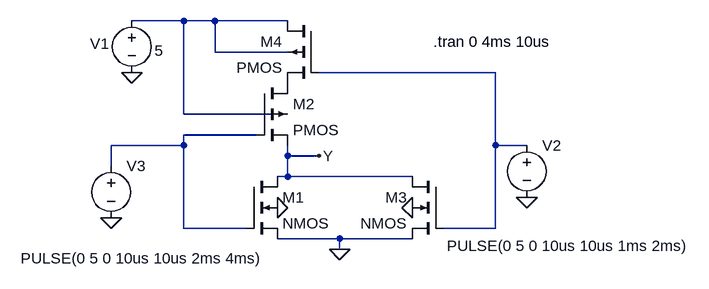
[diagram p0: schematic NOR2.asc]
NOR2.asc, the LTspice schematic file:
Version 4
SHEET 1 1048 680
WIRE -64 -192 -144 -192
WIRE -16 -192 -64 -192
WIRE 96 -192 -16 -192
WIRE -16 -144 -16 -192
WIRE 96 -144 -16 -144
WIRE 416 -112 144 -112
WIRE -64 -48 -64 -192
WIRE 96 -48 -64 -48
WIRE 48 -16 -64 -16
WIRE -64 0 -64 -16
WIRE -64 0 -176 0
WIRE 416 0 416 -112
WIRE 464 0 416 0
WIRE 96 16 96 0
WIRE 144 16 96 16
WIRE -176 32 -176 0
WIRE 96 48 96 16
WIRE 96 48 80 48
WIRE 288 48 96 48
WIRE -64 128 -64 0
WIRE 32 128 -64 128
WIRE 416 128 416 0
WIRE 416 128 336 128
WIRE 176 144 80 144
WIRE 288 144 176 144
WIRE 176 160 176 144
FLAG 80 96 0
FLAG 288 96 0
FLAG -144 -112 0
FLAG 464 80 0
FLAG -176 112 0
FLAG 176 160 0
FLAG 144 16 Y
SYMBOL voltage -144 -208 R0
WINDOW 123 0 0 Left 2
WINDOW 39 0 0 Left 2
WINDOW 0 -64 51 Left 2
WINDOW 3 35 62 Left 2
SYMATTR InstName V1
SYMATTR Value 5
SYMBOL voltage 464 -16 R0
WINDOW 3 -123 171 Left 2
WINDOW 123 0 0 Left 2
WINDOW 39 0 0 Left 2
SYMATTR Value PULSE(0 5 0 10us 10us 1ms 2ms)
SYMATTR InstName V2
SYMBOL voltage -176 16 R0
WINDOW 3 -139 158 Left 2
WINDOW 123 0 0 Left 2
WINDOW 39 0 0 Left 2
SYMATTR Value PULSE(0 5 0 10us 10us 2ms 4ms)
SYMATTR InstName V3
SYMBOL nmos4 32 48 R0
SYMATTR InstName M1
SYMATTR Value2 l=2 w=10
SYMBOL nmos4 336 48 M0
SYMATTR InstName M3
SYMATTR Value2 l=2 w=10
SYMBOL pmos4 48 -96 R0
SYMATTR InstName M2
SYMATTR Value2 l=2 w=10
SYMBOL pmos4 144 -192 M0
SYMATTR InstName M4
SYMATTR Value2 l=2 w=10
TEXT 320 -160 Left 2 !.tran 0 4ms 10us

The netlist it stands for:
* NOR2.asc
V1 N001 0 5
V2 N002 0 PULSE(0 5 0 10us 10us 1ms 2ms)
V3 N003 0 PULSE(0 5 0 10us 10us 2ms 4ms)
M1 Y N003 0 0 NMOS l=2 w=10
M3 Y N002 0 0 NMOS l=2 w=10
M2 P001 N003 Y N001 PMOS l=2 w=10
M4 N001 N002 P001 N001 PMOS l=2 w=10
.model NMOS NMOS
.model PMOS PMOS
.lib standard.mos
.tran 0 4ms 10us
.backanno
.end